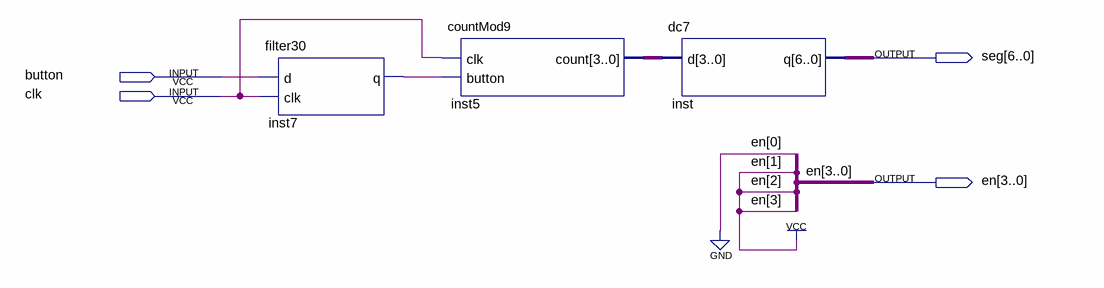
[diagram p0: schematic sheet]
// Quartus schematic VERILOGStart02.bdf as structural Verilog: 3 symbols, 4 pins
module VERILOGStart02 (
  input  button,
  input  clk,
  output [6:0] seg,
  output [3:0] en
);

  wire inst7_q;
  wire [3:0] inst5_count;

  filter30 inst7 (.d(button), .clk(clk), .q(inst7_q));
  countMod9 inst5 (.clk(clk), .button(inst7_q), .count(inst5_count));
  dc7 inst (.d(inst5_count), .q(seg));

  assign en = 4'b1110;
endmodule
